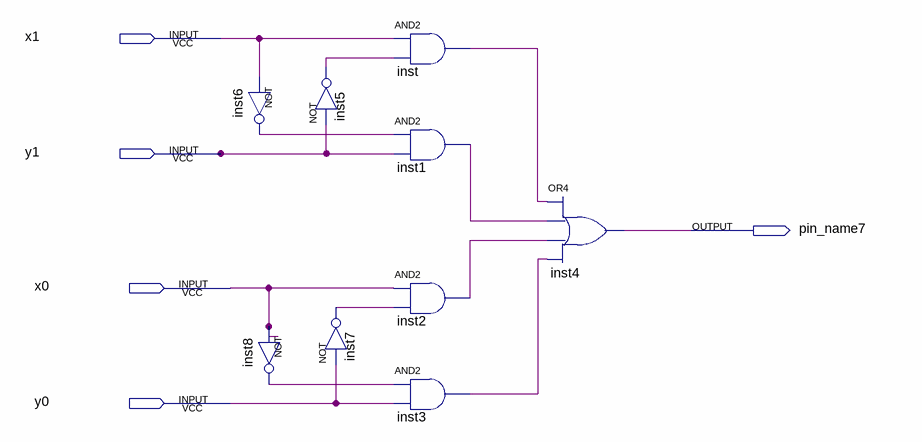
[diagram p0: schematic sheet]
// Quartus schematic dual1.bdf as structural Verilog: 9 symbols, 5 pins
module dual1 (
  input  x1,
  input  y1,
  input  x0,
  input  y0,
  output pin_name7
);

  wire inst1_out, inst2_out, inst3_out, inst5_out, inst6_out, inst7_out, inst8_out, inst_out;

  not inst6 (inst6_out, x1);
  not inst5 (inst5_out, y1);
  not inst7 (inst7_out, y0);
  not inst8 (inst8_out, x0);
  and inst (inst_out, x1, inst5_out);
  and inst1 (inst1_out, inst6_out, y1);
  and inst2 (inst2_out, x0, inst7_out);
  and inst3 (inst3_out, inst8_out, y0);
  or inst4 (pin_name7, inst_out, inst1_out, inst2_out, inst3_out);
endmodule
